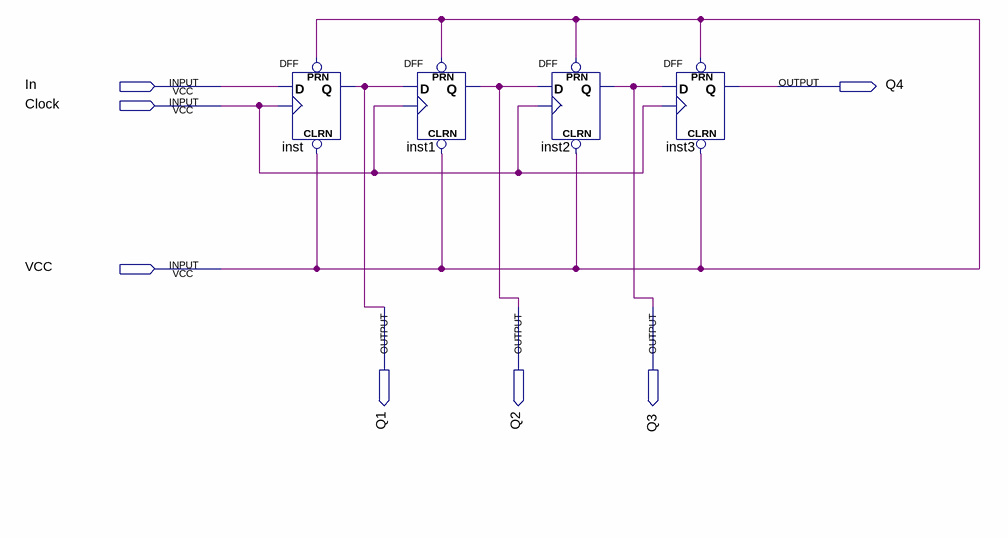
[diagram p0: schematic sheet]
// Quartus schematic lab10step1.bdf as structural Verilog: 4 symbols, 7 pins
module lab10step1 (
  input  In,
  input  Clock,
  input  VCC,
  output Q4,
  output Q1,
  output Q2,
  output Q3
);

  DFF inst (.CLRN(VCC), .CLK(Clock), .D(In), .PRN(VCC), .Q(Q1));
  DFF inst1 (.CLRN(VCC), .CLK(Clock), .D(Q1), .PRN(VCC), .Q(Q2));
  DFF inst2 (.CLRN(VCC), .CLK(Clock), .D(Q2), .PRN(VCC), .Q(Q3));
  DFF inst3 (.CLRN(VCC), .CLK(Clock), .D(Q3), .PRN(VCC), .Q(Q4));
endmodule
